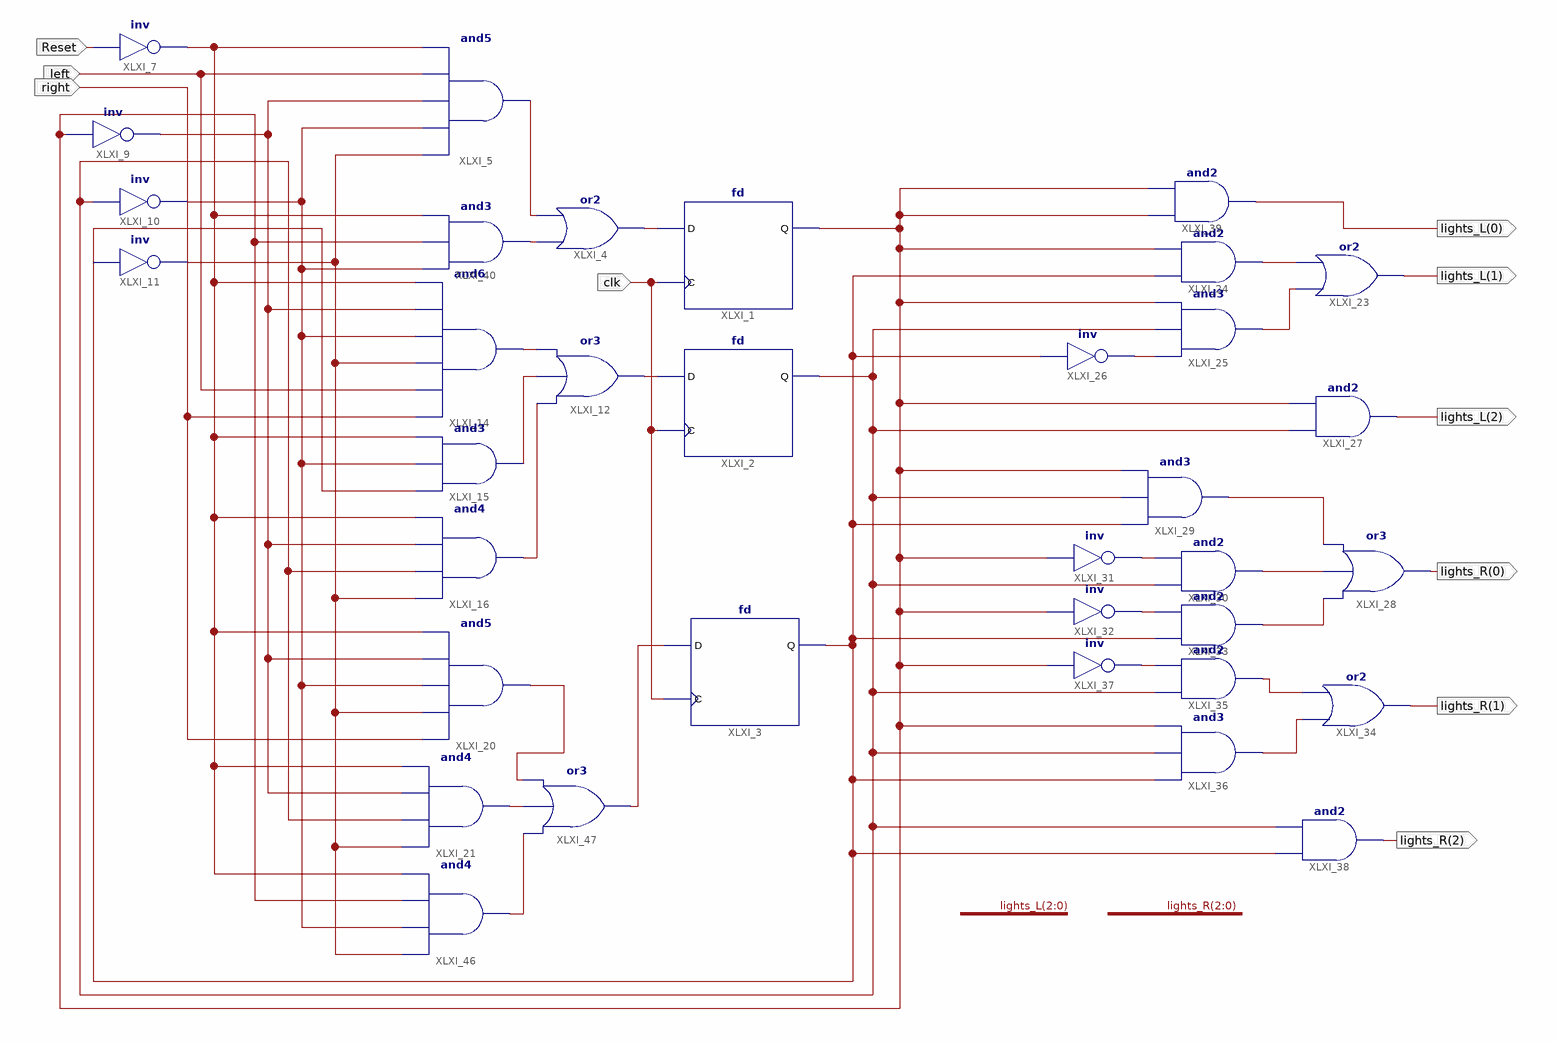
[diagram p0: schematic sheet 1]
// Xilinx ISE schematic thunderbird_fsm.sch (spartan3e) as structural Verilog: 35 symbols, 10 ports
module thunderbird_fsm (
  input  clk,
  input  Reset,
  input  left,
  input  right,
  output [2:0] lights_L,
  output [2:0] lights_R
);

  wire XLXN_1, XLXN_2, XLXN_4, XLXN_8, XLXN_12, XLXN_15, XLXN_17, XLXN_18, XLXN_19, XLXN_20, XLXN_26,
       XLXN_27, XLXN_30, XLXN_31, XLXN_32, XLXN_35, XLXN_38, XLXN_40, XLXN_42, XLXN_45, XLXN_47, XLXN_48,
       XLXN_50, XLXN_52, XLXN_58, XLXN_59, XLXN_65, XLXN_84, XLXN_92;

  fd XLXI_1 (.C(clk), .D(XLXN_1), .Q(XLXN_84));
  fd XLXI_2 (.C(clk), .D(XLXN_19), .Q(XLXN_18));
  fd XLXI_3 (.C(clk), .D(XLXN_30), .Q(XLXN_40));
  or XLXI_4 (XLXN_1, XLXN_4, XLXN_2);
  and XLXI_5 (XLXN_2, XLXN_17, XLXN_15, XLXN_12, left, XLXN_8);
  not XLXI_7 (XLXN_8, Reset);
  not XLXI_9 (XLXN_12, XLXN_84);
  not XLXI_10 (XLXN_15, XLXN_18);
  not XLXI_11 (XLXN_17, XLXN_40);
  or XLXI_12 (XLXN_19, XLXN_27, XLXN_26, XLXN_20);
  and XLXI_14 (XLXN_20, right, left, XLXN_17, XLXN_15, XLXN_12, XLXN_8);
  and XLXI_15 (XLXN_26, XLXN_40, XLXN_15, XLXN_8);
  and XLXI_16 (XLXN_27, XLXN_17, XLXN_18, XLXN_12, XLXN_8);
  and XLXI_20 (XLXN_31, right, XLXN_17, XLXN_15, XLXN_12, XLXN_8);
  and XLXI_21 (XLXN_32, XLXN_17, XLXN_18, XLXN_12, XLXN_8);
  or XLXI_23 (lights_L[1], XLXN_38, XLXN_35);
  and XLXI_24 (XLXN_35, XLXN_40, XLXN_84);
  and XLXI_25 (XLXN_38, XLXN_42, XLXN_18, XLXN_84);
  not XLXI_26 (XLXN_42, XLXN_40);
  and XLXI_27 (lights_L[2], XLXN_18, XLXN_84);
  or XLXI_28 (lights_R[0], XLXN_52, XLXN_47, XLXN_45);
  and XLXI_29 (XLXN_45, XLXN_40, XLXN_18, XLXN_84);
  and XLXI_30 (XLXN_47, XLXN_18, XLXN_48);
  not XLXI_31 (XLXN_48, XLXN_84);
  not XLXI_32 (XLXN_50, XLXN_84);
  and XLXI_33 (XLXN_52, XLXN_40, XLXN_50);
  or XLXI_34 (lights_R[1], XLXN_59, XLXN_58);
  and XLXI_35 (XLXN_58, XLXN_18, XLXN_65);
  and XLXI_36 (XLXN_59, XLXN_40, XLXN_18, XLXN_84);
  not XLXI_37 (XLXN_65, XLXN_84);
  and XLXI_38 (lights_R[2], XLXN_40, XLXN_18);
  and XLXI_39 (lights_L[0], XLXN_84, XLXN_84);
  and XLXI_40 (XLXN_4, XLXN_15, XLXN_84, XLXN_8);
  and XLXI_46 (XLXN_92, XLXN_17, XLXN_15, XLXN_84, XLXN_8);
  or XLXI_47 (XLXN_30, XLXN_92, XLXN_32, XLXN_31);
endmodule
